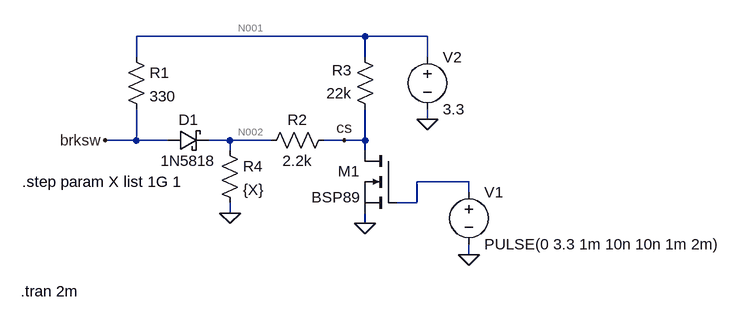
[diagram p0: schematic Draft1.asc]
Draft1.asc, the LTspice schematic file:
Version 4
SHEET 1 908 680
WIRE 336 48 -16 48
WIRE 432 48 336 48
WIRE -16 80 -16 48
WIRE 336 80 336 48
WIRE 432 80 432 48
WIRE 432 176 432 160
WIRE -16 208 -16 160
WIRE -16 208 -64 208
WIRE 32 208 -16 208
WIRE 128 208 96 208
WIRE 192 208 128 208
WIRE 304 208 272 208
WIRE 336 208 336 160
WIRE 336 208 304 208
WIRE 128 224 128 208
WIRE 336 224 336 208
WIRE 496 272 416 272
WIRE 496 288 496 272
WIRE 416 304 416 272
WIRE 416 304 384 304
WIRE 128 320 128 304
WIRE 336 336 336 320
WIRE 496 384 496 368
FLAG 336 336 0
FLAG 432 176 0
FLAG 304 208 cs
FLAG 128 320 0
FLAG -64 208 brksw
FLAG 496 384 0
SYMBOL res 288 192 R90
WINDOW 0 0 56 VBottom 2
WINDOW 3 32 56 VTop 2
SYMATTR InstName R2
SYMATTR Value 2.2k
SYMBOL res 352 176 R180
WINDOW 0 36 76 Left 2
WINDOW 3 36 40 Left 2
SYMATTR InstName R3
SYMATTR Value 22k
SYMBOL voltage 496 272 R0
WINDOW 123 0 0 Left 0
WINDOW 39 0 0 Left 0
SYMATTR InstName V1
SYMATTR Value PULSE(0 3.3 1m 10n 10n 1m 2m)
SYMBOL voltage 432 64 R0
WINDOW 123 0 0 Left 0
WINDOW 39 0 0 Left 0
SYMATTR InstName V2
SYMATTR Value 3.3
SYMBOL res 112 208 R0
SYMATTR InstName R4
SYMATTR Value {X}
SYMBOL nmos 384 224 M0
SYMATTR InstName M1
SYMATTR Value BSP89
SYMBOL schottky 32 224 R270
WINDOW 0 32 32 VTop 2
WINDOW 3 0 32 VBottom 2
SYMATTR InstName D1
SYMATTR Value 1N5818
SYMATTR Description Diode
SYMATTR Type diode
SYMBOL res -32 64 R0
SYMATTR InstName R1
SYMATTR Value 330
TEXT -192 272 Left 2 !.step param X list 1G 1
TEXT -194 440 Left 2 !.tran 2m

The netlist it stands for:
* Draft1.asc
R2 cs N002 2.2k
R3 cs N001 22k
V1 N003 0 PULSE(0 3.3 1m 10n 10n 1m 2m)
V2 N001 0 3.3
R4 N002 0 {X}
M1 cs N003 0 0 BSP89
D1 brksw N002 1N5818
R1 N001 brksw 330
.model D D
.lib standard.dio
.model NMOS NMOS
.model PMOS PMOS
.lib standard.mos
.step param X list 1G 1
.tran 2m
.backanno
.end

* Results of the author's LTspice run, read from the files saved beside the schematic
* Operating Point (first step), zero values left out:
*   x = 1 
*   V(cs) = 308.6 mV
*   V(n002) = 9.493 mV
*   V(n001) = 3.3 V
*   V(brksw) = 212.1 mV
*   I(D1) = 9.357 mA
*   I(R1) = 9.357 mA
*   I(R4) = 9.493 mA
*   I(R3) = -136 µA
*   I(R2) = 136 µA
*   I(V2) = -9.493 mA
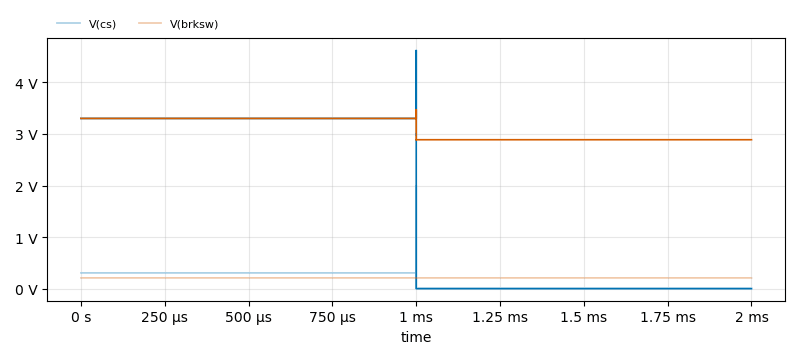
[diagram p1: Transient Analysis of Draft1.asc, plotted from the saved traces]
* Transient Analysis, 2 runs:
*   V(cs) [x=1]: min 687.7 µV, max 2.009 V, average 154.7 mV, rms 218.3 mV, last 687.7 µV
*   V(cs) [x=1e+009]: min 6.256 mV, max 4.618 V, average 1.653 V, rms 2.333 V, last 6.256 mV
*   V(brksw) [x=1]: min 211.9 mV, max 212.8 mV, average 212 mV, rms 212 mV, last 211.9 mV
*   V(brksw) [x=1e+009]: min 2.879 V, max 3.471 V, average 3.094 V, rms 3.101 V, last 2.888 V